# Altium schematic sheet led.SchDoc
size A4; SheetNumber: 4; SheetTotal: 4
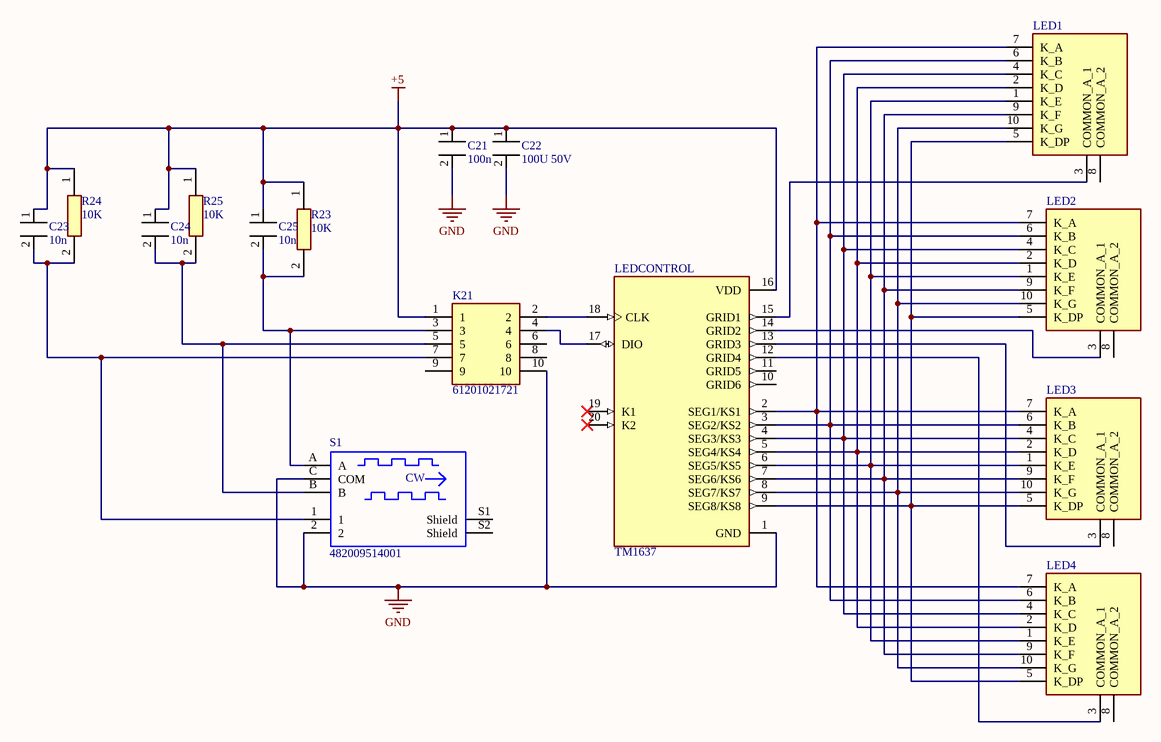
[diagram p0: led.SchDoc]

## Parts
C21  100n  [FP-CRCW0805-e3-IPC_A]
C22  100U 50V  [FP-CRCW0805-e3-IPC_A]
C23  10n  [FP-CRCW0805-e3-IPC_A]
C24  10n  [FP-CRCW0805-e3-IPC_A]
C25  10n  [FP-CRCW0805-e3-IPC_A]
K21  61201021721  [SHDRRA10W64P254X254_2X5_2036X885X910P]
LED1  HDSP-511A  [HDSP511A]  (value not drawn)
LED2  HDSP-511A  [HDSP511A]  (value not drawn)
LED3  HDSP-511A  [HDSP511A]  (value not drawn)
LED4  HDSP-511A  [HDSP511A]  (value not drawn)
LEDCONTROL  TM1637  [DIP778W43P254L2612H431Q20N]
R23  10K  [FP-CRCW0805-e3-IPC_A]
R24  10K  [FP-CRCW0805-e3-IPC_A]
R25  10K  [FP-CRCW0805-e3-IPC_A]
S1  482009514001  [4820xx514001]

## Nets
+5: C21.1(+) C22.1(+) C23.1(+) C24.1(+) C25.1(+) K21.1 LEDCONTROL.16(VDD) R23.1 R24.1 R25.1
GND: C21.2(-) C22.2(-) K21.10 LEDCONTROL.1(GND) S1.2 S1.C(COM)
NetC23_2: C23.2(-) K21.7 R24.2 S1.1
NetC24_2: C24.2(-) K21.5 R25.2 S1.B
NetC25_2: C25.2(-) K21.3 R23.2 S1.A
NetK21_2: K21.2 LEDCONTROL.18(CLK)
NetK21_4: K21.4 LEDCONTROL.17(DIO)
NetLED1_1: LED1.1(K_E) LED2.1(K_E) LED3.1(K_E) LED4.1(K_E) LEDCONTROL.6(SEG5/KS5)
NetLED1_2: LED1.2(K_D) LED2.2(K_D) LED3.2(K_D) LED4.2(K_D) LEDCONTROL.5(SEG4/KS4)
NetLED1_3: LED1.3(COMMON_A_1) LEDCONTROL.15(GRID1)
NetLED1_4: LED1.4(K_C) LED2.4(K_C) LED3.4(K_C) LED4.4(K_C) LEDCONTROL.4(SEG3/KS3)
NetLED1_5: LED1.5(K_DP) LED2.5(K_DP) LED3.5(K_DP) LED4.5(K_DP) LEDCONTROL.9(SEG8/KS8)
NetLED1_6: LED1.6(K_B) LED2.6(K_B) LED3.6(K_B) LED4.6(K_B) LEDCONTROL.3(SEG2/KS2)
NetLED1_7: LED1.7(K_A) LED2.7(K_A) LED3.7(K_A) LED4.7(K_A) LEDCONTROL.2(SEG1/KS1)
NetLED1_9: LED1.9(K_F) LED2.9(K_F) LED3.9(K_F) LED4.9(K_F) LEDCONTROL.7(SEG6/KS6)
NetLED1_10: LED1.10(K_G) LED2.10(K_G) LED3.10(K_G) LED4.10(K_G) LEDCONTROL.8(SEG7/KS7)
NetLED2_3: LED2.3(COMMON_A_1) LEDCONTROL.14(GRID2)
NetLED3_3: LED3.3(COMMON_A_1) LEDCONTROL.13(GRID3)
NetLED4_3: LED4.3(COMMON_A_1) LEDCONTROL.12(GRID4)

Not connected (* = marked no-connect by the designer): K21 6 8 9; LED1 8(COMMON_A_2); LED2 8(COMMON_A_2); LED3 8(COMMON_A_2); LED4 8(COMMON_A_2); LEDCONTROL 10(GRID6) 11(GRID5) 19(K1)* 20(K2)*; S1 S1(Shield) S2(Shield)

## Notes on the sheet
- (in symbol 482009514001) CW

## Library data of the parts
C21-C25 = MAL215097101E3: Capacitor Polarised; Manufacturer_Name: Vishay; Datasheet Link: https://componentsearchengine.com/Datasheets/2/MAL215097101E3.pdf; Height: 10.5mm; Manufacturer_Part_Number: MAL215097101E3
K21 = 61201021721: Connector; Manufacturer_Name: Wurth Elektronik; Datasheet Link: https://componentsearchengine.com//61201021721.pdf; Height: 9.1mm; Mouser2 Part Number: 710-61201021721; Mouser2 Price/Stock: https://www.mouser.com/Search/Refine.aspx?Keyword=710-61201021721; Manufacturer_Part_Number: 61201021721
LED1-LED4 = HDSP-511A: Display; Manufacturer_Name: Avago Technologies; Datasheet Link: https://datasheet.datasheetarchive.com/originals/distributors/SFDatasheet-4/sf-00083626.pdf; Height: 8mm; Mouser2 Part Number: 630-HDSP-511A; Mouser2 Price/Stock: https://www.mouser.com/Search/Refine.aspx?Keyword=630-HDSP-511A; Manufacturer_Part_Number: HDSP-511A
LEDCONTROL = TM1637: LED Drive Control Special Circuit; MF: Titan Micro Electronics; Package: Package; Availability: Not in stock; SnapEDA_Link: https://www.snapeda.com/parts/TM1637/Titan+Micro+Electronics/view-part/?ref=snap; MP: TM1637; Check_prices: https://www.snapeda.com/parts/TM1637/Titan+Micro+Electronics/view-part/?ref=eda; Value: *; Price: None
R23-R25 = CHP0805AFX-1000ELF: Resistor; Manufacturer_Name: Bourns; Datasheet Link: https://www.mouser.cn/datasheet/2/54/chp-a-1858677.pdf; Height: 0.6mm; Manufacturer_Part_Number: CHP0805AFX-1000ELF
S1 = 482009514001: WS-ENTV Mechanical Incremental Encoder Switch, Metal Shaft with bushing, 8Pulse/360deg, 16positions, 10mA; Manufacturer: Wurth Elektronik; Electrical Life Switch: 20000Cycles; Electrical Life Encoder: 15000Cycles; Insulation Resistance: 100MOhm; Operation Force: 600g; ComponentLink1Description: Manufacturer; ComponentLink1URL: http://www.we-online.de; ComponentLink2Description: Datasheet; ComponentLink2URL: https://www.we-online.com/catalog/datasheet/482009514001.pdf; Mounting Technology: THT; Manufacturer Part Number: 482009514001; Published Date: May 2021; Detent: 16positions; Operating Temperature: -40 to +85degC; Packaging: Tray; Resolution: 8Pulse/360deg; Rated Current: 10mA; Size: L13.75W11.7H26.6